# EAGLE design sensores (EAGLE 9.6.2)
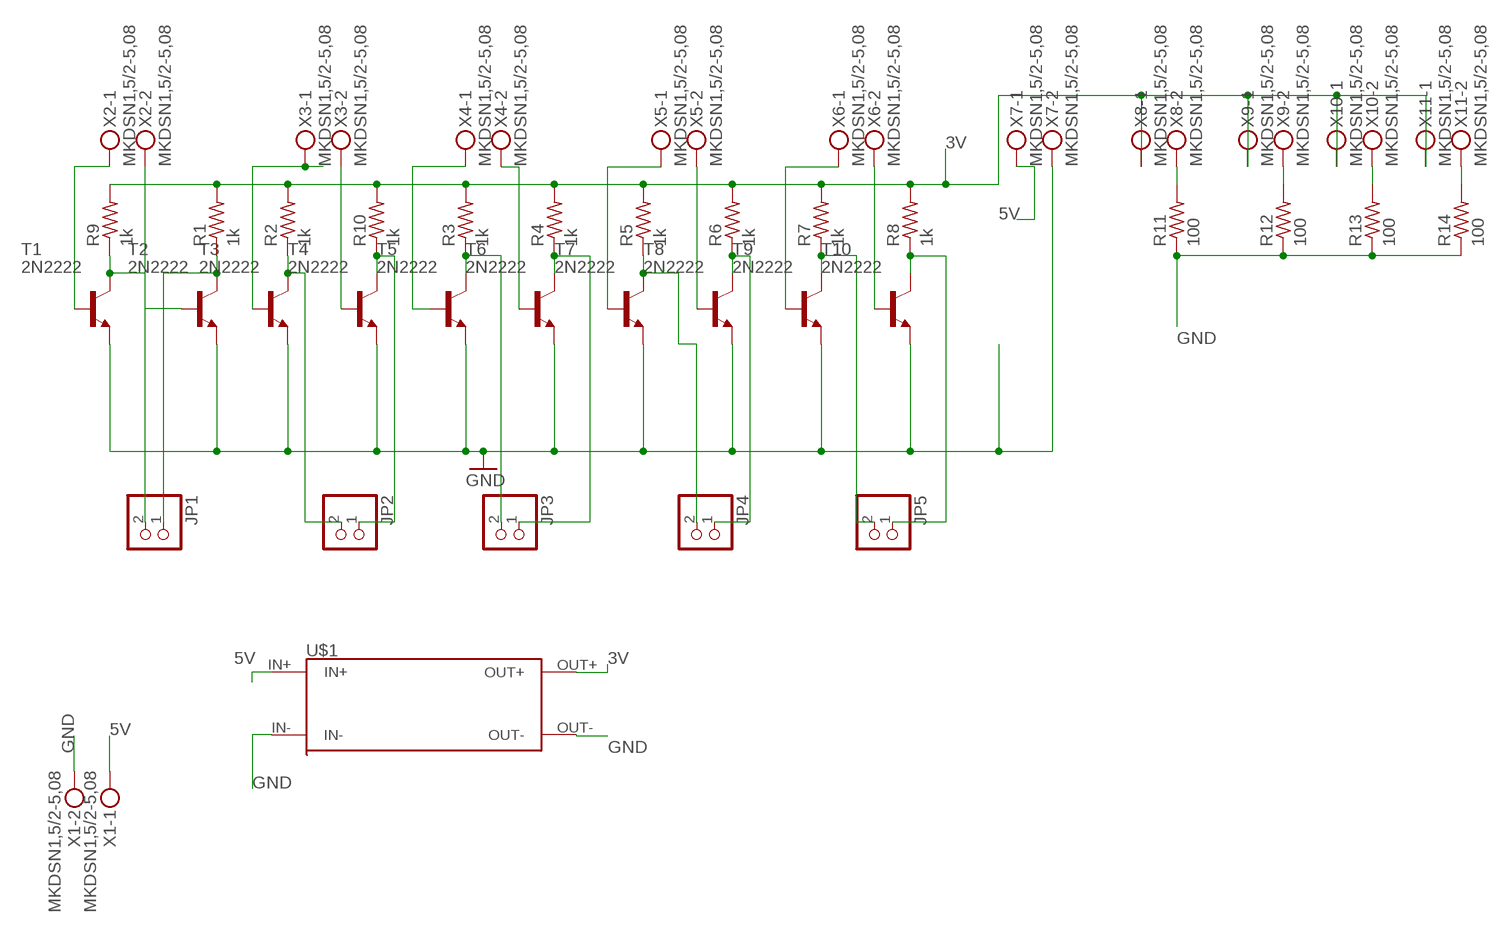
[diagram p0: schematic, sheet 1]

## Parts
JP1  PINHD-1X2  [1X02]
JP2  PINHD-1X2  [1X02]
JP3  PINHD-1X2  [1X02]
JP4  PINHD-1X2  [1X02]
JP5  PINHD-1X2  [1X02]
R1  1k  R-US_0207/10  [0207/10]
R2  1k  R-US_0207/10  [0207/10]
R3  1k  R-US_0207/10  [0207/10]
R4  1k  R-US_0207/10  [0207/10]
R5  1k  R-US_0207/10  [0207/10]
R6  1k  R-US_0207/10  [0207/10]
R7  1k  R-US_0207/10  [0207/10]
R8  1k  R-US_0207/10  [0207/10]
R9  1k  R-US_0207/10  [0207/10]
R10  1k  R-US_0207/10  [0207/10]
R11  100  R-US_0207/10  [0207/10]
R12  100  R-US_0207/10  [0207/10]
R13  100  R-US_0207/10  [0207/10]
R14  100  R-US_0207/10  [0207/10]
T1  2N2222  [2N2222]
T2  2N2222  [2N2222]
T3  2N2222  [2N2222]
T4  2N2222  [2N2222]
T5  2N2222  [2N2222]
T6  2N2222  [2N2222]
T7  2N2222  [2N2222]
T8  2N2222  [2N2222]
T9  2N2222  [2N2222]
T10  2N2222  [2N2222]
U$1  LM2596  [LM2596]
X1  MKDSN1,5/2-5,08  [MKDSN1,5/2-5,08]
X2  MKDSN1,5/2-5,08  [MKDSN1,5/2-5,08]
X3  MKDSN1,5/2-5,08  [MKDSN1,5/2-5,08]
X4  MKDSN1,5/2-5,08  [MKDSN1,5/2-5,08]
X5  MKDSN1,5/2-5,08  [MKDSN1,5/2-5,08]
X6  MKDSN1,5/2-5,08  [MKDSN1,5/2-5,08]
X7  MKDSN1,5/2-5,08  [MKDSN1,5/2-5,08]
X8  MKDSN1,5/2-5,08  [MKDSN1,5/2-5,08]
X9  MKDSN1,5/2-5,08  [MKDSN1,5/2-5,08]
X10  MKDSN1,5/2-5,08  [MKDSN1,5/2-5,08]
X11  MKDSN1,5/2-5,08  [MKDSN1,5/2-5,08]

## Nets
3V: R1.2 R2.2 R3.2 R4.2 R5.2 R6.2 R7.2 R8.2 R9.2 R10.2 U$1.OUT+ X8.1 X9.1 X10.1 X11.1
5V: U$1.IN+ X1.1 X7.1
GND: R11.1 R12.1 R13.1 R14.1 T1.E T2.E T3.E T4.E T5.E T6.E T7.E T8.E T9.E T10.E U$1.IN- U$1.OUT- X1.2 X7.2
N$1: T1.B X2.1
N$2: T4.B X3.2
N$3: T2.B X2.2
N$4: T3.B X3.1
N$5: T5.B X4.1
N$6: T6.B X4.2
N$7: T7.B X5.1
N$8: T8.B X5.2
N$9: T9.B X6.1
N$10: T10.B X6.2
N$11: JP3.1 R4.1 T6.C
N$12: JP1.1 R1.1 T2.C
N$13: JP2.2 R2.1 T3.C
N$14: JP3.2 R3.1 T5.C
N$15: JP4.2 R5.1 T7.C
N$16: JP4.1 R6.1 T8.C
N$17: JP5.2 R7.1 T9.C
N$18: JP5.1 R8.1 T10.C
N$19: JP1.2 R9.1 T1.C
N$20: JP2.1 R10.1 T4.C
N$21: R11.2 X8.2
N$22: R12.2 X9.2
N$23: R13.2 X10.2
N$24: R14.2 X11.2

## Library data of the parts
JP1-JP5 = pinhead:PINHD-1X2: PIN HEADER
R1-R14 = rcl:R-US_: RESISTOR, American symbol; SPICEPREFIX: R
T1-T10 = local:2N2222: NPN TRANSISTOR
U$1 = local:LM2596
X1-X11 = local:MKDSN1,5/2-5,08: MKDSN 1,5/ 2-5,08 Printklemme Nennstrom: 13,5 A Nennspannung: 250 V Rastermaß: 5,08 mm Polzahl: 2 Anschlussart: Schraubanschluss Montage: Löten Anschlussrichtung Leiter/Platine: 0 ° Artikelnummer: 1729128 Source: http://eshop.phoenixcontact.com .. 1729128.pdf

## Board
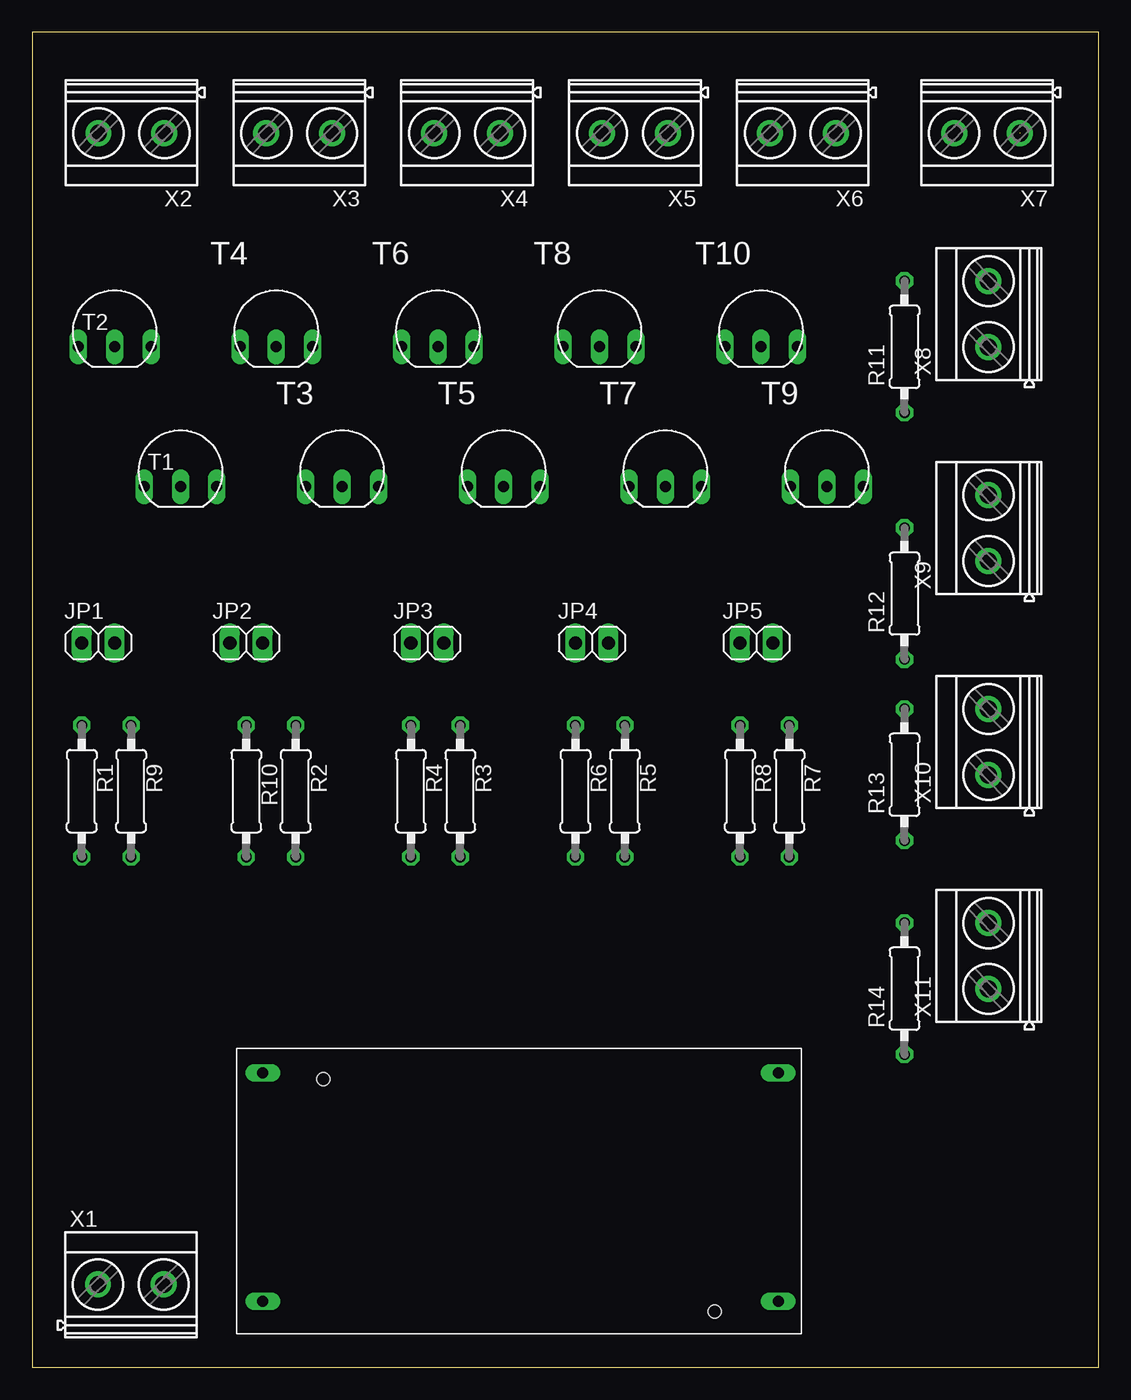
[diagram p1: board, top side]
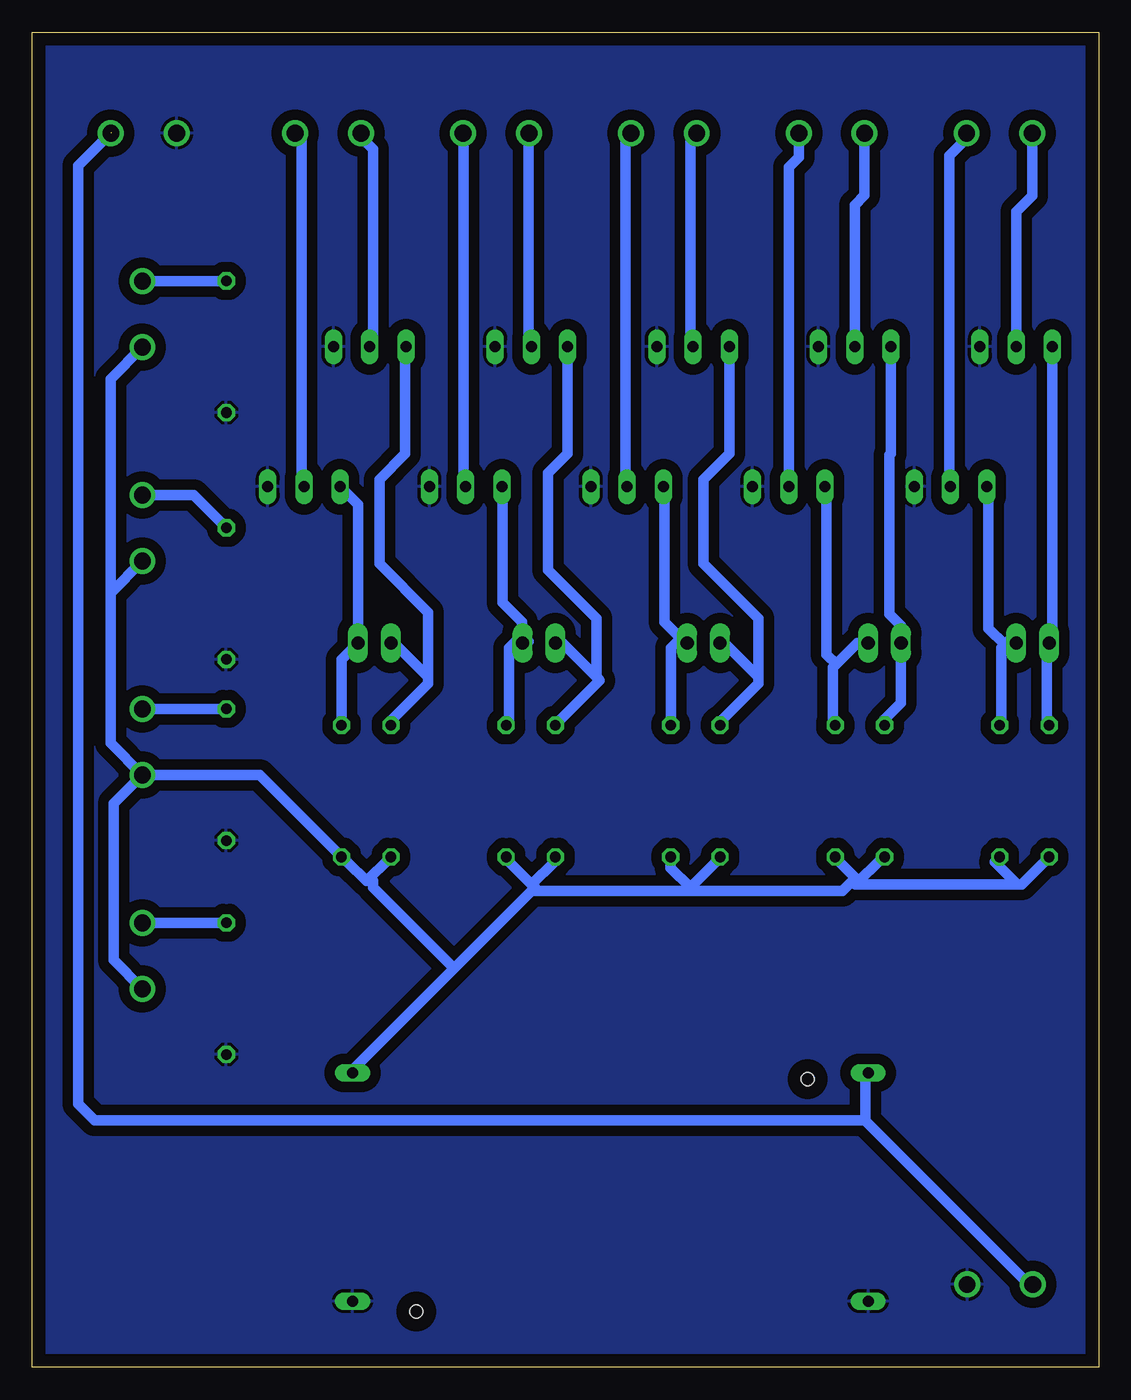
[diagram p2: board, bottom side, seen from below]

Size 82.28 x 103 mm. Coordinates in mm from the lower left corner, seen from the top.
Outline: 0,0 82.28,0 82.28,103 0,103 0,0
Copper layers (1*16): Top 0.035mm / dielectric 1.5mm / Bottom 0.035mm
Design rules "default *": minimum track width 32mil, minimum drill 0.35mm, track to track 32mil, track to pad 32mil, pad to pad 32mil, via to via 32mil, smd to smd 6mil, copper to edge 40mil, drill to drill 32mil, minimum pad ring 10mil, minimum via ring 8mil, stop-mask expansion 4mil, vias tented up to drill 0mil, thermal gap 10mil

### Footprints (pad centres in the part's own frame; a part is rotated, then mirrored left to right if it is on the bottom)
1X02 = drill 1.016 long: 1 -1.27,0; 2 1.27,0
0207/10 = drill 0.813 octagon: 1 -5.08,0; 2 5.08,0
2N2222 = drill 0.85 long: B 0,0; C -2.8,0; E 2.8,0
LM2596 = drill 0.85 long: IN+ 0,17.62; IN- 0,0; OUT+ 39.79,17.62; OUT- 39.79,0 | hole 1: 4.67,17.14; 34.88,-0.8
MKDSN1,5/2-5,08 = drill 1.3 pad 2: 1 -2.561,0.025; 2 2.519,0.025

### Placement (x,y rotation side)
JP1  5.08,55.88 0 top
JP2  16.51,55.88 0 top
JP3  30.48,55.88 0 top
JP4  43.18,55.88 0 top
JP5  55.88,55.88 0 top
R1  3.81,44.45 270 top
R2  20.32,44.45 270 top
R3  33.02,44.45 270 top
R4  29.21,44.45 270 top
R5  45.72,44.45 270 top
R6  41.91,44.45 270 top
R7  58.42,44.45 270 top
R8  54.61,44.45 270 top
R9  7.62,44.45 270 top
R10  16.51,44.45 270 top
R11  67.31,78.74 90 top
R12  67.31,59.69 90 top
R13  67.31,45.72 90 top
R14  67.31,29.21 90 top
T1  11.43,67.94 0 top
T2  6.35,78.74 0 top
T3  23.9,67.94 0 top
T4  18.82,78.74 0 top
T5  36.37,67.94 0 top
T6  31.29,78.74 0 top
T7  48.85,67.94 0 top
T8  43.77,78.74 0 top
T9  61.32,67.94 0 top
T10  56.24,78.74 0 top
U$1  17.78,5.08 0 top
X1  7.62,6.35 0 top
X2  7.62,95.25 180 top
X3  20.57,95.25 180 top
X4  33.53,95.25 180 top
X5  46.48,95.25 180 top
X6  59.44,95.25 180 top
X7  73.66,95.25 180 top
X8  73.81,81.28 90 top
X9  73.81,64.77 90 top
X10  73.81,48.26 90 top
X11  73.81,31.75 90 top

### Tracks (layer width: path | path; a pad name or v marks a point on that pad's centre or on a via)
3V
  Bottom 0.813: 56.25,37.75 56.5,37.5 58,39 R7.2 64.75,45.7 X10.1 | 56.25,37.75 55,39 R8.2 | 43.75,37.25 42,39 R6.2 | 43.75,36.75 43.5,37 43.75,37.25 | 43.75,36.75 49.75,30.75 | 49.75,30.75 57.5,23 U$1.OUT+ | 49.75,30.75 56,37 56,37.5 56.25,37.75 | 6.25,37.25 8,39 R9.2 | 18.75,37.75 20,39 R2.2 | 18.75,37.75 18.5,37.5 17,39 R10.2 | 31.5,37 31.25,36.75 | 19,37.5 18.75,37.75 | 31.25,36.75 19.75,36.75 19,37.5 | 19,37.5 18.75,37.25 6.25,37.25 | 6.25,37.25 5.93,37.25 R1.2 | 31.5,37 29.21,39.29 R4.2 | R3.2 33.02,38.52 31.5,37 | 31.25,36.75 43.75,36.75 | R5.2 45.72,39.22 43.75,37.25 | 76.25,59.74 X9.1 | 76.25,59.74 76.25,76.25 X8.1 | X10.1 76.25,48.16 76.25,59.74 | X10.1 76.01,43.48 76.01,31.41 X11.1
5V  (1 unrouted)
  Bottom 0.813: 18,19 18,22.5 U$1.IN+ | 18,19 5.5,6.5 X1.1 | 18,19 18.05,19.05 77.47,19.05 78.74,20.32 78.74,92.71 76.2,95.25
GND
  pour Bottom: 0,0 0,102.87 82.55,102.87 82.55,0
N$1
  Bottom 0.813: T1.B 11.5,68 11.5,93.5 10,95 X2.1
N$2
  Bottom 0.813: X3.2 18.05,90.44 18.82,89.68 T4.B
N$3
  Bottom 0.813: X2.2 5.1,90.4 6.35,89.15 T2.B
N$4
  Bottom 0.813: X3.1 23.14,93.36 23.9,92.6 T3.B
N$5
  Bottom 0.813: T5.B 36.5,68 36.5,95 X4.1
N$6
  Bottom 0.813: T6.B 31.5,79 31.5,95 X4.2
N$7
  Bottom 0.813: T7.B 49,68 49,94.5 48.5,95 49,95.5 X5.1
N$8
  Bottom 0.813: T8.B 44,79 44,95 X5.2
N$9
  Bottom 0.813: T9.B 61.5,68 61.5,95 X6.1
N$10
  Bottom 0.813: T10.B 56,79 56,94 57,95 X6.2
N$11
  Bottom 0.813: T6.C 28.5,70.5 30.5,68.5 30.5,62 26.25,57.75 26.25,53.25 | R4.1 29.21,49.79 26.25,52.75 26.25,53.25 | JP3.1 28.88,55.88 26.25,53.25
N$12
  Bottom 0.813: R1.1 4,50 4,55.5 JP1.1 3.55,56.14 T2.C
N$13
  Bottom 0.813: 20.25,54.25 20.5,54 20.5,50 R2.1 | 20.25,54.25 21,55 21,67.5 T3.C | JP2.2 18.62,55.88 20.25,54.25
N$14
  Bottom 0.813: R3.1 33,50 33,55.5 32,56.5 31.5,56 JP3.2 32.5,56.5 33.5,57.5 33.5,67.5 T5.C
N$15
  Bottom 0.813: 44.5,56.5 45.5,55.5 45.5,50 R5.1 | 44.5,56.5 44,56 JP4.2 44.5,56.5 | 44.5,56.5 44.5,57.5 46,59 46,67.5 T7.C
N$16
  Bottom 0.813: 38.75,53.25 41.5,56 JP4.1 | 38.75,53.25 38.5,53 41.5,50 R6.1 | T8.C 41,78.71 41,70.5 42.5,69 42.5,61.5 38.75,57.75 38.75,53.25
N$17
  Bottom 0.813: T9.C 57.15,66.58 JP5.2 58.42,54.61 R7.1
N$18
  Bottom 0.813: T10.C 53.5,78.68 53.5,70.5 55.5,68.5 55.5,62 51.75,58.25 51.75,53.25 | JP5.1 54.38,55.88 51.75,53.25 | R8.1 54.61,49.89 51.75,52.75 51.75,53.25
N$19
  Bottom 0.813: 7.25,55.75 6.5,56.5 6,56 JP1.2 | 7.25,55.75 7.5,55.5 7.5,49.65 R9.1 | 7.25,55.75 8.5,57 8.5,67.81 T1.C
N$20
  Bottom 0.813: T4.C 16.02,70.48 16.13,70.37 16.13,58.13 15.24,57.24 JP2.1 15.24,51.26 16.51,49.99 R10.1
N$21
  Bottom 0.813: R11.2 73.77,83.82 X8.2
N$22
  Bottom 0.813: X9.2 69.83,67.29 R12.2
N$23
  Bottom 0.813: R13.2 73.77,50.8 X10.2
N$24
  Bottom 0.813: X11.2 67.33,34.27 R14.2